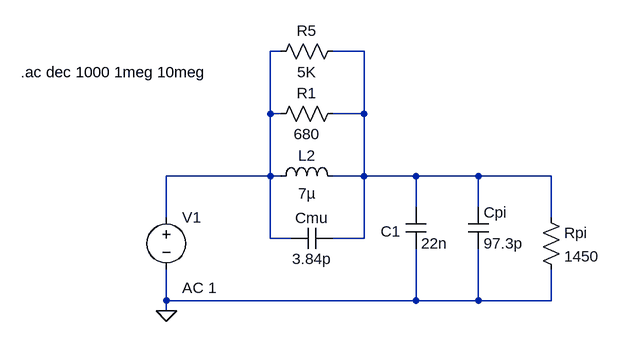
[diagram p0: schematic lc2.xasc.asc]
lc2.xasc.asc, the LTspice schematic file:
Version 4
SHEET 1 880 680
WIRE 352 -96 336 -96
WIRE 480 -96 432 -96
WIRE 336 0 336 -96
WIRE 352 0 336 0
WIRE 480 0 480 -96
WIRE 480 0 432 0
WIRE 336 96 336 0
WIRE 336 96 176 96
WIRE 352 96 336 96
WIRE 480 96 480 0
WIRE 480 96 432 96
WIRE 560 96 480 96
WIRE 656 96 560 96
WIRE 768 96 656 96
WIRE 560 144 560 96
WIRE 656 144 656 96
WIRE 176 160 176 96
WIRE 768 160 768 96
WIRE 336 192 336 96
WIRE 368 192 336 192
WIRE 480 192 480 96
WIRE 480 192 432 192
WIRE 176 288 176 240
WIRE 560 288 560 208
WIRE 560 288 176 288
WIRE 656 288 656 208
WIRE 656 288 560 288
WIRE 768 288 768 240
WIRE 768 288 656 288
WIRE 176 304 176 288
FLAG 176 304 0
SYMBOL res 448 -16 R90
WINDOW 0 0 56 VBottom 2
WINDOW 3 32 56 VTop 2
SYMATTR InstName R1
SYMATTR Value 680
SYMBOL ind 336 112 R270
WINDOW 0 32 56 VTop 2
WINDOW 3 5 56 VBottom 2
SYMATTR InstName L2
SYMATTR Value 7µ
SYMBOL cap 544 144 R0
WINDOW 0 -38 37 Left 2
SYMATTR InstName C1
SYMATTR Value 22n
SYMBOL res 448 -112 R90
WINDOW 0 0 56 VBottom 2
WINDOW 3 32 56 VTop 2
SYMATTR InstName R5
SYMATTR Value 5K
SYMBOL voltage 176 144 R0
WINDOW 123 24 124 Left 2
WINDOW 39 0 0 Left 0
SYMATTR Value2 AC 1
SYMATTR InstName V1
SYMATTR Value ""
SYMBOL cap 432 176 R90
WINDOW 0 0 32 VBottom 2
WINDOW 3 32 32 VTop 2
SYMATTR InstName Cmu
SYMATTR Value 3.84p
SYMBOL cap 640 144 R0
SYMATTR InstName Cpi
SYMATTR Value 97.3p
SYMBOL res 752 144 R0
SYMATTR InstName Rpi
SYMATTR Value 1450
TEXT -48 -64 Left 2 !.ac dec 1000 1meg 10meg

The netlist it stands for:
* lc2.xasc.asc
R1 N002 N001 680
L2 N001 N002 7µ
C1 N002 0 22n
R5 N002 N001 5K
V1 N001 0 AC 1
Cmu N002 N001 3.84p
Cpi N002 0 97.3p
Rpi N002 0 1450
.ac dec 1000 1meg 10meg
.backanno
.end